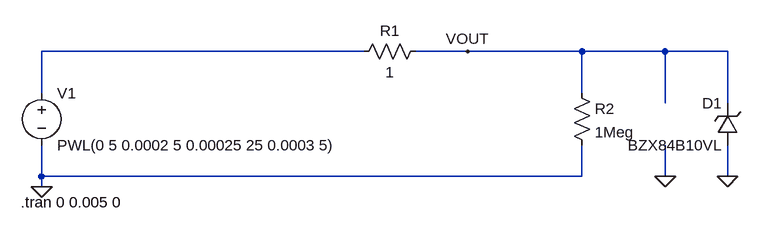
[diagram p0: schematic Overvoltage.asc]
Overvoltage.asc, the LTspice schematic file:
Version 4
SHEET 1 1128 680
WIRE 544 64 48 64
WIRE 704 64 624 64
WIRE 880 64 704 64
WIRE 1008 64 880 64
WIRE 1104 64 1008 64
WIRE 48 128 48 64
WIRE 880 128 880 64
WIRE 1008 144 1008 64
WIRE 1104 144 1104 64
WIRE 48 256 48 208
WIRE 880 256 880 208
WIRE 880 256 48 256
WIRE 1008 256 1008 208
WIRE 1104 256 1104 208
WIRE 48 272 48 256
FLAG 48 272 0
FLAG 704 64 VOUT
FLAG 1008 256 0
FLAG 1104 256 0
SYMBOL voltage 48 112 R0
WINDOW 123 0 0 Left 0
WINDOW 39 0 0 Left 0
SYMATTR InstName V1
SYMATTR Value PWL(0 5 0.0002 5 0.00025 25 0.0003 5)
SYMBOL res 864 112 R0
SYMATTR InstName R2
SYMATTR Value 1Meg
SYMBOL res 640 48 R90
WINDOW 0 0 56 VBottom 2
WINDOW 3 32 56 VTop 2
SYMATTR InstName R1
SYMATTR Value 1
SYMBOL zener 1120 208 R180
WINDOW 0 24 64 Left 2
WINDOW 3 24 0 Left 2
SYMATTR InstName D1
SYMATTR Value BZX84B10VL
SYMATTR Description Diode
SYMATTR Type diode
TEXT 16 296 Left 2 !.tran 0 0.005 0

The netlist it stands for:
* Overvoltage.asc
V1 N001 0 PWL(0 5 0.0002 5 0.00025 25 0.0003 5)
R2 VOUT 0 1Meg
R1 VOUT N001 1
D1 0 VOUT BZX84B10VL
.model D D
.lib standard.dio
.tran 0 0.005 0
.backanno
.end